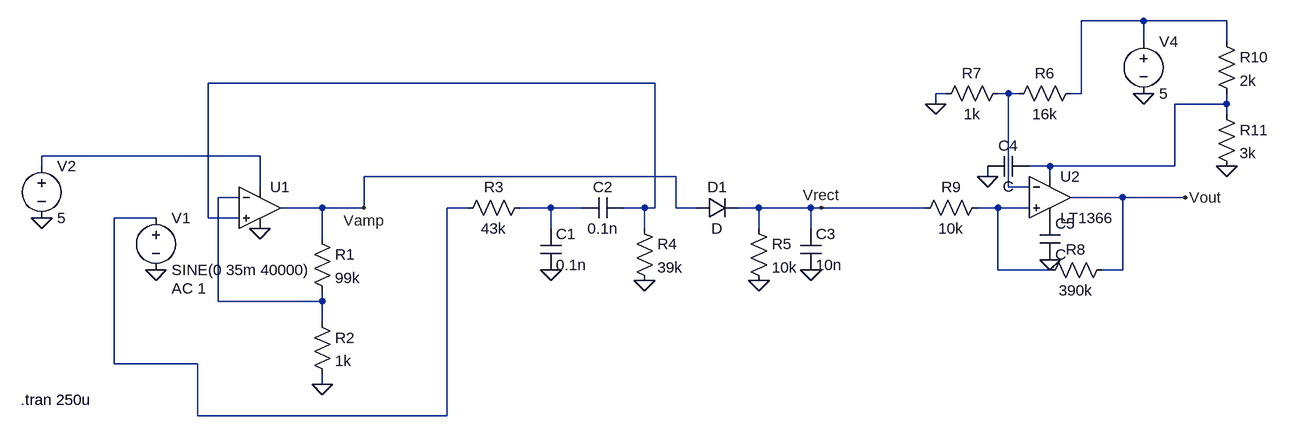
[diagram p0: schematic Ultrasonic Full Circuit FINAL w Capacitors.asc]
Ultrasonic Full Circuit FINAL w Capacitors.asc, the LTspice schematic file:
Version 4.1
SHEET 1 1640 680
WIRE 368 -176 272 -176
WIRE 496 -176 368 -176
WIRE 368 -144 368 -176
WIRE 496 -144 496 -176
WIRE -384 -80 -1072 -80
WIRE 64 -64 48 -64
WIRE 160 -64 144 -64
WIRE 176 -64 160 -64
WIRE 272 -64 272 -176
WIRE 272 -64 256 -64
WIRE 48 -48 48 -64
WIRE 496 -48 496 -64
WIRE 496 -48 416 -48
WIRE 496 -32 496 -48
WIRE -992 32 -1328 32
WIRE -1328 48 -1328 32
WIRE 224 48 192 48
WIRE 416 48 416 -48
WIRE 416 48 224 48
WIRE -352 64 -832 64
WIRE 128 64 128 48
WIRE 224 64 224 48
WIRE -992 80 -992 32
WIRE 160 80 160 -64
WIRE 192 80 160 80
WIRE -1024 96 -1056 96
WIRE 336 96 256 96
WIRE 432 96 336 96
WIRE -896 112 -960 112
WIRE -832 112 -832 64
WIRE -832 112 -896 112
WIRE -672 112 -704 112
WIRE -544 112 -592 112
WIRE -496 112 -544 112
WIRE -400 112 -432 112
WIRE -384 112 -384 -80
WIRE -384 112 -400 112
WIRE -352 112 -352 64
WIRE -320 112 -352 112
WIRE -224 112 -256 112
WIRE -144 112 -224 112
WIRE -128 112 -144 112
WIRE 32 112 -128 112
WIRE 144 112 112 112
WIRE 192 112 144 112
WIRE -1152 128 -1216 128
WIRE -1072 128 -1072 -80
WIRE -1024 128 -1072 128
WIRE -544 144 -544 112
WIRE -400 144 -400 112
WIRE -224 144 -224 112
WIRE -144 144 -144 112
WIRE -896 160 -896 112
WIRE 144 208 144 112
WIRE 224 208 144 208
WIRE 336 208 336 96
WIRE 336 208 304 208
WIRE -1056 256 -1056 96
WIRE -896 256 -896 240
WIRE -896 256 -1056 256
WIRE -896 288 -896 256
WIRE -1216 352 -1216 128
WIRE -1088 352 -1216 352
WIRE -896 384 -896 368
WIRE -1088 432 -1088 352
WIRE -704 432 -704 112
WIRE -704 432 -1088 432
FLAG -896 384 0
FLAG -832 112 Vamp
FLAG -1152 208 0
FLAG -1328 128 0
FLAG -992 144 0
FLAG -400 224 0
FLAG -544 208 0
FLAG -224 224 0
FLAG -144 208 0
FLAG -128 112 Vrect
FLAG 368 -64 0
FLAG 48 -48 0
FLAG 496 48 0
FLAG 432 96 Vout
FLAG 128 64 0
FLAG 224 192 0
SYMBOL res -912 144 R0
SYMATTR InstName R1
SYMATTR Value 99k
SYMBOL res -912 272 R0
SYMATTR InstName R2
SYMATTR Value 1k
SYMBOL voltage -1152 112 R0
WINDOW 123 24 124 Left 2
WINDOW 39 0 0 Left 0
SYMATTR Value2 AC 1
SYMATTR InstName V1
SYMATTR Value SINE(0 35m 40000)
SYMBOL voltage -1328 32 R0
SYMATTR InstName V2
SYMATTR Value 5
SYMBOL OpAmps\\UniversalOpAmp -992 112 R0
SYMATTR InstName U1
SYMBOL res -576 96 R90
WINDOW 0 0 56 VBottom 2
WINDOW 3 32 56 VTop 2
SYMATTR InstName R3
SYMATTR Value 43k
SYMBOL cap -560 144 R0
SYMATTR InstName C1
SYMATTR Value 0.1n
SYMBOL cap -432 96 R90
WINDOW 0 0 32 VBottom 2
WINDOW 3 32 32 VTop 2
SYMATTR InstName C2
SYMATTR Value 0.1n
SYMBOL res -416 128 R0
SYMATTR InstName R4
SYMATTR Value 39k
SYMBOL diode -320 128 R270
WINDOW 0 32 32 VTop 2
WINDOW 3 0 32 VBottom 2
SYMATTR InstName D1
SYMBOL res -240 128 R0
SYMATTR InstName R5
SYMATTR Value 10k
SYMBOL cap -160 144 R0
SYMATTR InstName C3
SYMATTR Value 10n
SYMBOL voltage 368 -160 R0
SYMATTR InstName V4
SYMATTR Value 5
SYMBOL res 272 -80 R90
WINDOW 0 0 56 VBottom 2
WINDOW 3 32 56 VTop 2
SYMATTR InstName R6
SYMATTR Value 16k
SYMBOL res 160 -80 R90
WINDOW 0 0 56 VBottom 2
WINDOW 3 32 56 VTop 2
SYMATTR InstName R7
SYMATTR Value 1k
SYMBOL res 320 192 R90
WINDOW 0 0 56 VBottom 2
WINDOW 3 32 56 VTop 2
SYMATTR InstName R8
SYMATTR Value 390k
SYMBOL res 128 96 R90
WINDOW 0 0 56 VBottom 2
WINDOW 3 32 56 VTop 2
SYMATTR InstName R9
SYMATTR Value 10k
SYMBOL res 480 -160 R0
SYMATTR InstName R10
SYMATTR Value 2k
SYMBOL res 480 -48 R0
SYMATTR InstName R11
SYMATTR Value 3k
SYMBOL OpAmps\\LT1366 224 32 R0
SYMATTR InstName U2
SYMBOL cap 192 32 R90
WINDOW 0 0 32 VBottom 2
WINDOW 3 32 32 VTop 2
SYMATTR InstName C4
SYMBOL cap 208 128 R0
SYMATTR InstName C5
TEXT -1360 408 Left 2 !.tran 250u

The netlist it stands for:
* Ultrasonic Full Circuit FINAL w Capacitors.asc
R1 Vamp N006 99k
R2 N006 0 1k
V1 N007 0 SINE(0 35m 40000) AC 1
V2 N005 0 5
X§U1 N002 N006 N005 0 Vamp level1 Avol=1Meg GBW=10Meg Vos=0 En=0 Enk=0 In=0 Ink=0 Rin=500Meg  ; pins In+ In- V+ V- OUT
R3 N008 N007 43k
C1 N008 0 0.1n
C2 N002 N008 0.1n
R4 N002 0 39k
D1 Vamp Vrect D
R5 Vrect 0 10k
C3 Vrect 0 10n
V4 N001 0 5
R6 N001 N003 16k
R7 N003 0 1k
R8 Vout N009 390k
R9 N009 Vrect 10k
R10 N001 N004 2k
R11 N004 0 3k
X§U2 N009 N003 N004 P001 Vout LT1366  ; pins In+ In- V+ V- OUT
C4 N004 0 C
C5 P001 0 C
.model D D
.lib standard.dio
.tran 250u
.lib UniversalOpAmp1.lib
.lib LTC.lib
.backanno
.end